# EasyEDA Pro project ProProject_无线温湿度检测系统1_2024-10-27.epro, board V2.1
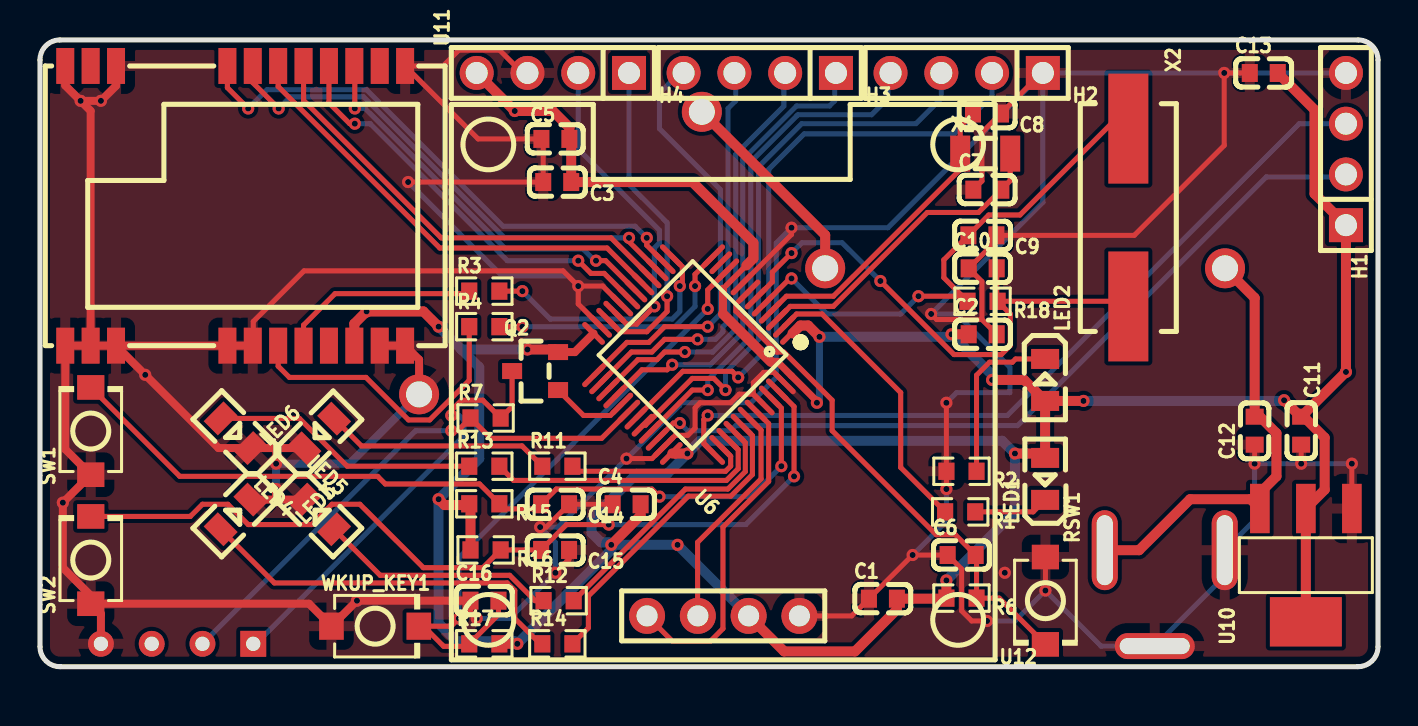
[diagram p11: board, top side]
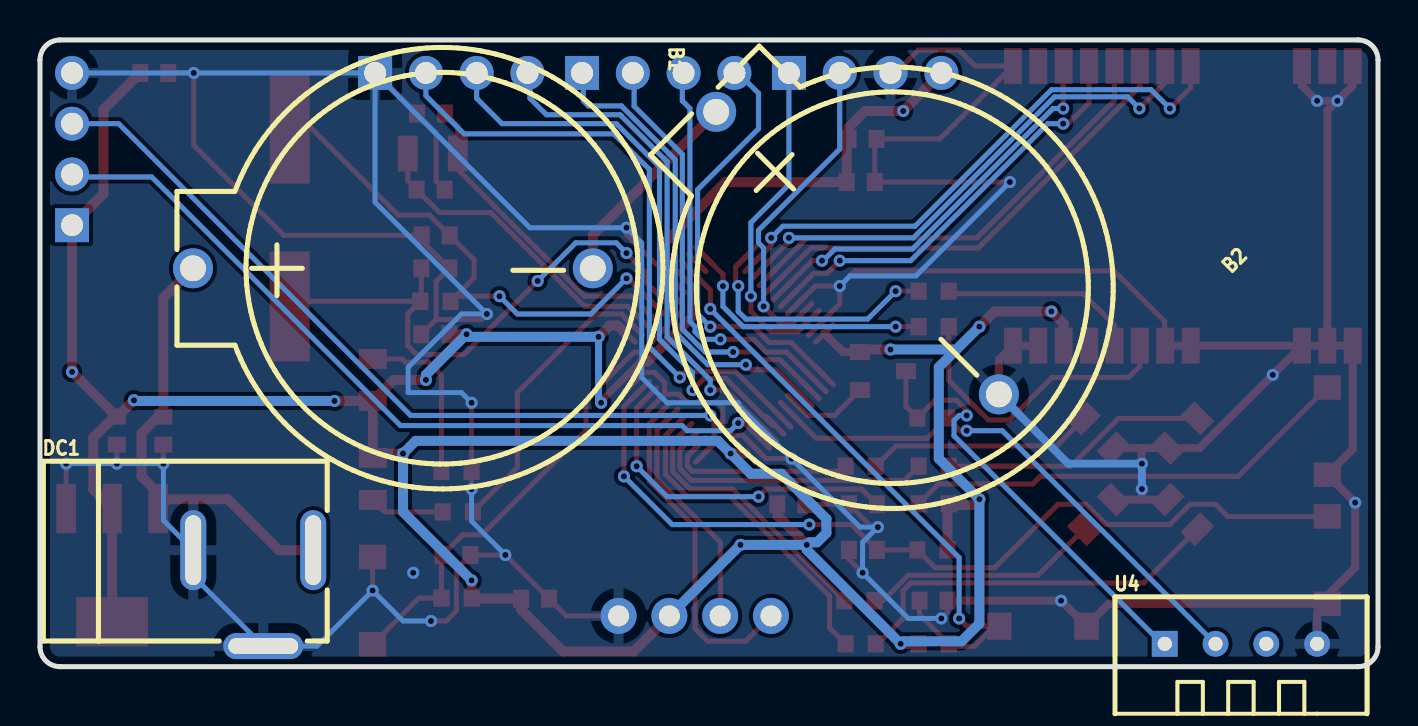
[diagram p12: board, bottom side, seen from below]

Outline 66.93 x 31.37 mm; copper layers: Top Layer, Inner1, Inner2, Bottom Layer. Coordinates in mm from the lower left corner of the outline.
Outline path: 0,30.37 0,1 arc(0.29,0.29) 1,0 65.93,0 arc(66.64,0.29) 66.93,1 66.93,30.37 arc(66.64,31.08) 65.93,31.37 1,31.37 arc(0.29,31.08) 0,30.37
Stack: Top Layer 0.035mm 外层铜厚1oz / Dielectric1 0.2104mm 7628 RC49% 8.6mil / Inner1 0.0152mm 内层铜厚 / Dielectric2 1.065mm 1.1mm H/HOZ 含铜 / Inner2 0.0152mm 内层铜厚 / Dielectric3 0.2104mm 7628 RC49% 8.6mil / Bottom Layer 0.035mm 外层铜厚1oz

## Design rules (mm)
template: JLCPCB Capability(Two Layers Board)
spacing copperThickness1oz (default): track to track 0.102, other pairs 0.152 to 0.3
spacing copperThickness2oz: track to track 0.203, other pairs 0.152 to 0.3
track width copperThickness1oz (default): min 0.127, default 0.254, max 2.54
track width copperThickness2oz: min 0.203, default 0.254, max 2.54
differential pair differentialPair (default): width min 0.127, default 0.254, max 2.54; gap min 0.152, default 0.152
via viaSize (default): diameter min 0.5, default 0.61, max 10; hole min 0.3, default 0.305, max 6.3

## Placement (name value [footprint] x y rotation side)
B1  BS-2-1  [BAT-TH_BS-2-1]  49.28 19.94 270 bottom
B2  BS-2-1  [BAT-TH_BS-2-1]  26.03 20.7 315 bottom
C1  100nF  [C0603]  42.16 3.4 0 top
C2  100nF  [C0603]  47.16 16.64 0 top
C3  100nF  [C0603]  25.87 24.26 180 top
C4  100nF  [C0603]  29.34 8.13 0 top
C5  100nF  [C0603]  25.78 26.42 0 top
C6  1uF  [C0603]  46.1 5.59 0 top
C7  20pF  [C0603]  47.39 23.88 0 top
C8  20pF  [C0603]  47.37 27.69 180 top
C9  20pF  [C0603]  47.14 21.59 180 top
C10  20pF  [c0603]  47.16 19.94 0 top
C11  100nF  [C0603]  63.09 11.81 270 top
C12  1uF  [C0603]  60.76 11.81 90 top
C13  1uF  [C0603]  61.21 29.72 0 top
C14  1uF  [C0603]  25.77 8.13 180 top
C15  1uF  [C0603]  25.77 5.84 180 top
C16  1uF  [C0603]  22.23 3.3 0 top
DC1  DC-005 2.0  [DC-IN-TH_DC-5520-1]  56.26 3.43 180 bottom
H1  烧录  [HDR-TH_4P-P2.54-V-M]  65.32 25.91 90 top
H2  烧录  [HDR-TH_4P-P2.54-V-M]  46.35 29.72 180 top
H3  烧录  [HDR-TH_4P-P2.54-V-M]  36 29.72 180 top
H4  烧录  [HDR-TH_4P-P2.54-V-M]  25.65 29.72 180 top
LED1  NCD0805R1  [LED0805-R-RD]  50.28 9.4 90 top
LED2  NCD0805R1  [LED0805-R-RD]  50.28 14.35 270 top
LED3  NCD0805R1  [LED0805-R-RD]  9.78 7.62 225 top
LED4  NCD0805R1  [LED0805-R-RD]  9.78 11.68 135 top
LED5  NCD0805R1  [LED0805-R-RD]  13.97 7.62 315 top
LED6  NCD0805R1  [LED0805-R-RD]  13.97 11.67 45 top
Q2  AO3401A  [SOT-23_L2.9-W1.3-P1.90-LS2.4-BR]  24.76 14.8 0 top
R1  510Ω  [R0603]  46.03 7.75 180 top
R2  510Ω  [R0603]  46.09 9.78 180 top
R3  200Ω  [R0603]  22.22 18.8 0 top
R4  200Ω  [R0603]  22.22 17.02 0 top
R6  10kΩ  [R0603]  46.09 3.43 180 top
R7  4.7kΩ  [R0603]  22.29 12.45 0 top
R11  510Ω  [R0603]  25.88 10.03 0 top
R12  510Ω  [R0603]  25.94 3.3 0 top
R13  510Ω  [r0603]  22.22 10.03 0 top
R14  510Ω  [R0603]  25.88 1.14 0 top
R15  10kΩ  [R0603]  22.22 8.15 180 top
R16  10kΩ  [R0603]  22.29 5.84 180 top
R17  10kΩ  [R0603]  22.22 1.14 0 top
R18  1MΩ  [R0603]  47.15 18.29 180 top
RSW1  TS-1088R-02026  [SW-SMD_L3.9-W3.0-P4.45]  50.29 3.3 270 top
SW1  TS-1088-AR02016  [SW-SMD_L3.9-W3.0-P4.45]  2.54 11.79 90 top
SW2  TS-1088-AR02016  [SW-SMD_L3.9-W3.0-P4.45]  2.54 5.33 90 top
U4  DHT11  [SENSOR-TH_DHT11]  6.86 1.14 180 bottom
U6  STM32F103C8T6  [LQFP-48_L7.0-W7.0-P0.50-LS9.0-BL]  32.64 15.62 135 top
U10  AMS1117-3.3  [SOT-223-4_L6.5-W3.5-P2.30-LS7.0-BR]  63.32 5.08 90 top
U11  E22-400M22S  [WIRELM-SMD_E22-400M22S]  9.76 23.07 270 top
U12  HS96L03W2C03  [OLED-TH_L27.8-W27.2-P2.54_C9900033791]  34.18 2.54 180 top
WKUP_KEY1  TS-1088-AR02016  [SW-SMD_L3.9-W3.0-P4.45]  16.76 2.03 0 top
X1  32.768kHz  [FC-135R_L3.2-W1.5]  47.28 25.68 0 top
X2  8MHz  [CRYSTAL-SMD_L11.5-W4.8-LS12.7]  54.44 22.48 270 top

## Footprints (pads in the part's own frame, mm; a bottom-side part is the same pattern mirrored in y, then rotated)
BAT-TH_BS-2-1
  round 2 hole 1.3: 1(0,-10) 2(0,10)
C0603
  rect 0.8x0.9 smd: 1(-0.7,0) 2(0.7,0)
c0603
  rect 0.8x0.9 smd: 1(-0.7,0) 2(0.7,0)
CRYSTAL-SMD_L11.5-W4.8-LS12.7
  rect 5.5x2 smd: 1(-4.45,0) 2(4.45,0)
DC-IN-TH_DC-5520-1
  oval 4x1.3 hole 3.5x0.8: 2(0.5,-2.4)
  oval 1.3x4 hole 0.8x3.5: 3(-3,2.4) 4(3,2.4)
FC-135R_L3.2-W1.5
  rect 1x1.8 smd: 1(-1.25,0) 2(1.25,0)
HDR-TH_4P-P2.54-V-M
  rect 1.7x1.7 hole 1.1: 1(-3.81,0)
  round 1.7 hole 1.1: 2(-1.27,0) 3(1.27,0) 4(3.81,0)
LED0805-R-RD
  rect 1x1.399 smd: 1(1.05,0) 2(-1.05,0)
LQFP-48_L7.0-W7.0-P0.50-LS9.0-BL
  oval 0.27x1.5 smd: 1(-2.75,-4.25) 2(-2.25,-4.25) 3(-1.75,-4.25) 4(-1.25,-4.25) 5(-0.75,-4.25) 6(-0.25,-4.25) 7(0.25,-4.25) 8(0.75,-4.25) 9(1.25,-4.25) 10(1.75,-4.25) 11(2.25,-4.25) 12(2.75,-4.25) 25(2.75,4.25) 26(2.25,4.25) 27(1.75,4.25) 28(1.25,4.25) 29(0.75,4.25) 30(0.25,4.25) 31(-0.25,4.25) 32(-0.75,4.25) 33(-1.25,4.25) 34(-1.75,4.25) 35(-2.25,4.25) 36(-2.75,4.25)
  oval 1.5x0.27 smd: 13(4.25,-2.75) 14(4.25,-2.25) 15(4.25,-1.75) 16(4.25,-1.25) 17(4.25,-0.75) 18(4.25,-0.25) 19(4.25,0.25) 20(4.25,0.75) 21(4.25,1.25) 22(4.25,1.75) 23(4.25,2.25) 24(4.25,2.75) 37(-4.25,2.75) 38(-4.25,2.25) 39(-4.25,1.75) 40(-4.25,1.25) 41(-4.25,0.75) 42(-4.25,0.25) 43(-4.25,-0.25) 44(-4.25,-0.75) 45(-4.25,-1.25) 46(-4.25,-1.75) 47(-4.25,-2.25) 48(-4.25,-2.75)
OLED-TH_L27.8-W27.2-P2.54_C9900033791
  round 1.8 hole 1.05: 1(-3.81,0) 2(-1.27,0) 3(1.27,0) 4(3.81,0)
R0603
  rect 0.806x0.864 smd: 1(-0.753,0) 2(0.753,0)
r0603
  rect 0.806x0.864 smd: 1(-0.753,0) 2(0.753,0)
SENSOR-TH_DHT11
  rect 1.296x1.296 hole 0.711: 1(-3.81,0)
  round 1.296 hole 0.711: 2(-1.27,0) 3(1.27,0) 4(3.81,0)
SOT-23_L2.9-W1.3-P1.90-LS2.4-BR
  rect 1x0.8 smd: 1(1.15,-0.95) 2(1.15,0.95) 3(-1.15,0)
SOT-223-4_L6.5-W3.5-P2.30-LS7.0-BR
  rect 2.47x0.98 smd: 1(2.835,-2.3) 2(2.835,0) 3(2.835,2.3)
  rect 2.47x3.6 smd: 4(-2.835,0)
SW-SMD_L3.9-W3.0-P4.45
  rect 1.23x1.36 smd: 1(-2.185,0) 2(2.185,0)
WIRELM-SMD_E22-400M22S
  rect 1.8x0.9 smd: 1(7,-8.5) 2(7,-7.23) 3(7,-5.96) 4(7,-0.39) 5(7,0.88) 6(7,2.15) 7(7,3.42) 8(7,4.69) 9(7,5.96) 10(7,7.23) 11(7,8.5) 12(-7,8.5) 13(-7,7.23) 14(-7,5.96) 15(-7,4.69) 16(-7,3.42) 17(-7,2.15) 18(-7,0.88) 19(-7,-0.39) 20(-7,-5.96) 21(-7,-7.23) 22(-7,-8.5)

## Nets
As in the schematic.

Pads without a net: U4 3; U6 11; U11 8 13 21

## Via types
v1: diameter 0.61, hole 0.305, Top Layer to Bottom Layer, 78 vias

## Routing (per net, layer and track width the routed paths; a pad name or vN(x,y) marks a point on that pad's centre or on a via; arc(x,y) is an arc through that point)
12V&B_VCC: length 22.6
  Top Layer w0.5: B1.1 60.76,18.45 C12.2 61.02,12.51 61.85,11.68 61.85,9.53 61.02,8.7 61.02,7.92 60.55,8.38 57.53,8.38 54.98,5.83 53.26,5.83
GND: length 347.8
  Top Layer w0.25: R2.2 v1(45.34,13.21) ; R2.2 45.34,8.89 ; R2.2 v1(45.34,8.89) ; U6.44 35.68,13.64 ; 35.68,13.64 35.68,14.22 36.19,14.73 36.71,14.73 37.24,14.21 ; 35.68,13.64 34.98,13.64 34.54,13.21 33.02,13.21 32.77,12.95 32.77,11.94 32.41,11.58 31.78,11.58 U6.35 30.61,10.41 v1(29.34,10.41) ; v1(25.02,6.98) 25.32,6.98 C14.1 C4.1 ; C16.1 21.53,2.72 v1(21.84,2.41) ; C11.2 v1(63.09,10.16) ; v1(47.37,2.29) 46.61,2.29 46.1,2.79 46.1,4.89 C6.1 v1(43.65,5.59) C1.1 40.6,2.54 U12.1 ; 65.62,7.92 v1(65.62,10.16) ; RSW1.1 v1(50.29,3.81) ; C12.1 60.76,10.16 v1(60.76,10.16) ; C15.1 26.47,5.38 v1(25.78,4.7)
  Top Layer w0.254: U6.20 28.15,19.05 v1(26.92,19.05) ; H2.1 50.1,29.72 C8.1 47.12,26.73 47.12,24.31 C7.1 ; U6.8 37.59,21.63 v1(37.59,21.97) ; v1(44.58,17.65) 44.85,17.38 47.12,17.38 ; C13.1 60.51,29.72 v1(59.24,29.72) 59.24,26.09 54.74,21.59 C9.1 47.84,21.32 C10.1 47.12,19.28 47.12,17.38 ; 47.12,17.38 C2.2 ; 28.04,17.03 26.92,18.15 v1(26.92,19.05) ; v1(18.41,24.26) C3.2 25.17,26.33 25.08,26.42 21.91,26.42 U11.12 20.16,30.07 20.96,30.86 22.99,30.86 24.13,29.72 H4.3 ; v1(26.92,19.05) 26.16,19.81 13.21,19.81 10.67,17.27 10.67,16.09 U11.5
  Top Layer w0.4: U11.3 U11.4 U11.5 ; U11.3 U11.2 ; U11.3 v1(5.27,14.61) 8.93,10.94 LED4.2 11.83,10.94 ; LED3.2 11.8,8.36 ; 11.8,8.36 11.81,8.37 v1(11.81,8.89) ; 11.8,8.36 LED5.2 ; LED6.2 13.22,10.94 11.83,10.94 ; 11.83,10.94 11.83,10.17 v1(11.81,10.16) ; U11.20 3.8,29.08 v1(3.05,28.32) v1(2.03,28.32) ; U4.4 3.05,2.64 SW2.1 ; v1(2.03,28.32) 1.26,29.09 U11.22 ; v1(2.03,28.32) 2.53,27.82 U11.2 ; U11.2 U11.1 1.26,10.88 2.54,9.61 v1(1.14,8.21) 1.14,4.95 2.54,3.56 SW2.1 ; SW2.1 13.46,3.15 WKUP_KEY1.1 v1(15.85,3.3) C16.1 ; B2.2 18.96,15.37 U11.11 U11.10
  Bottom Layer w0.25: 45.47,13.33 45.85,13.72 48.51,13.72 48.51,14.99 45.85,17.65 v1(44.58,17.65) ; v1(65.62,10.16) v1(63.09,10.16) v1(60.76,10.16) 60.76,7.32 59.26,5.83 59.26,4.53 DC1.2 53.07,1.03 v1(50.29,3.81) 48.77,2.29 v1(47.37,2.29) ; v1(43.65,5.59) 45.34,7.28 v1(45.34,8.89) ; v1(37.59,21.97) 36.83,21.21 36.83,14.48 35.56,13.21 32,13.21 32,13.08 v1(29.34,10.41) 25.91,6.98 v1(25.02,6.98) 25.78,6.22 v1(25.78,4.7) 23.5,2.41 v1(21.84,2.41)
  Bottom Layer w0.254: v1(44.58,17.65) 50.16,23.24 H2.1 ; H2.1 v1(59.24,29.72) H1.4 ; H2.1 42.42,21.97 v1(37.59,21.97) ; v1(18.41,24.26) 23.11,19.56 26.42,19.56 v1(26.92,19.05)
  Bottom Layer w0.4: B2.2 15.49,10.16 v1(11.81,10.16) v1(11.81,8.89)
  vias: v1(48.26,4.7)
VCC: length 199.2
  Top Layer w0.25: U6.9 34.16,18.91
  Top Layer w0.35: v1(38.86,13.21) 38.86,13.29 U6.48 36.89,15.26
  Top Layer w0.4: 36.56,15.26 36.89,15.26 ; U6.24 26.75,15.75 Q2.2 ; 34.16,18.91 34.16,17.65
  Top Layer w0.5: 31.63,10.67 31.78,10.67 31.78,10.67 v1(32.38,10.67) ; C13.2 63.75,27.88 63.75,23.67 H1.1 v1(65.32,14.75) 63.15,12.57 ; 35.33,20.08 35.69,20.44 35.69,21.21 32.64,24.26 C3.1 26.57,26.33 C5.2 26.48,26.99 25.65,27.81 v1(23.75,27.81) H4.4 ; 21.53,8.09 20.23,8.09 v1(19.94,8.38) ; 21.53,8.09 R15.2 ; 21.53,8.09 R16.2 ; v1(45.59,16.64) C2.1 ; LED2.1 49.23,14.35 v1(47.62,14.35) ; LED2.1 LED1.1 50.06,10.67 v1(48.77,10.67) ; LED2.1 v1(52.2,13.3) ; v1(45.34,4.32) R6.2 45.31,3.4 C1.2 42.86,2.86 40.77,0.76 37.22,0.76 U12.2 ; 63.15,12.57 64.26,11.46 64.26,8.86 63.32,7.92 U10.4 ; 63.15,12.57 C11.1 63.05,12.51 v1(62.23,13.33) ; 37.64,16.68 38.03,17.07 38.42,17.07 v1(38.99,16.51) ; v1(19.94,17.02) 19.18,17.78 v1(16.34,17.78) 15.72,17.17 U11.9 ; v1(28.57,6.1) 30.04,7.56 C4.2 ; 34.16,17.65 36.56,15.26 ; Q2.2 25.78,15.88 v1(24.38,15.88) ; v1(23.88,1.14) R17.2
  Bottom Layer w0.35: v1(38.86,13.21) 38.99,13.33 v1(38.99,16.51)
  Bottom Layer w0.5: v1(28.57,6.1) v1(31.89,6.1) U12.2 ; v1(28.57,6.1) 28.45,6.22 28.06,6.22 27.59,6.69 27.59,7.4 29.84,9.65 31.37,9.65 v1(32.38,10.67) 33.02,11.3 48.13,11.3 v1(48.77,10.67) 48.77,7.75 v1(45.34,4.32) ; v1(28.57,6.1) 28.57,5.84 v1(23.88,1.14) 23.75,1.27 20.83,1.27 19.94,2.16 v1(19.94,8.38) 21.97,10.41 21.97,14.99 21.08,15.88 ; v1(47.62,14.35) 47.62,14.61 v1(45.59,16.64) 45.47,16.51 v1(38.99,16.51) ; 21.08,15.88 v1(19.94,17.02) ; 21.08,15.88 v1(24.38,15.88) ; v1(52.2,13.3) 62.2,13.3 v1(62.23,13.33)
DHT11_VCC: length 22.2
  Top Layer w0.254: 23.62,14.8 23.62,13.02 R7.2 22.15,13.33 21.08,13.33 20.57,12.83 v1(20.57,12.57)
  Bottom Layer w0.254: U4.1 10.79,1.14 21.21,11.56 21.21,12.32 20.96,12.57 v1(20.57,12.57)
NRST: length 25.8
  Top Layer w0.254: RSW1.2 47.98,3.43 46.85,3.43 46.85,5.54 C6.2 45.78,6.6 44.83,6.6 39.62,11.81 39.62,13.33 37.21,15.75 36.85,15.75 34.81,17.79 34.81,18.15 35.47,18.8
PA2/USART2_TX: length 13.1
  Top Layer w0.254: R4.2 v1(24.13,17.02) ; v1(32.77,19.05) 32.77,19.64 U6.12
  Bottom Layer w0.254: v1(32.77,19.05) 32.77,18.03 31.75,17.02 v1(24.13,17.02)
PA3/USART2_RX: length 12.8
  Top Layer w0.254: U6.13 32.13,20.02 32.13,19.18 v1(32,19.05) ; R3.2 v1(24.13,18.8)
  Bottom Layer w0.254: v1(32,19.05) 32,17.78 31.62,17.4 25.53,17.4 v1(24.13,18.8)
PA4/SPI1_NSS: length 27.6
  Top Layer w0.254: U11.19 9.37,28.98 v1(10.41,27.94) ; v1(30.35,21.46) 30.35,21.09 31.22,20.22
  Bottom Layer w0.254: v1(10.41,27.94) 11.35,28.88 16.33,28.88 23.16,22.05 29.77,22.05 v1(30.35,21.46)
PA5/SPI1_SCK: length 25.5
  Top Layer w0.254: v1(11.94,27.94) 10.64,29.23 U11.18 ; v1(29.46,21.46) 29.46,21.27 U6.15
  Bottom Layer w0.254: v1(29.46,21.46) 23.24,21.46 16.18,28.52 12.52,28.52 v1(11.94,27.94)
PA6/SPI1_MISO: length 22.7
  Top Layer w0.254: U6.16 28.56,21.46 20.07,21.46 13.18,28.34 U11.16
PA7/SPI1_MOSI: length 23.4
  Top Layer w0.254: U6.17 28.37,20.95 20,20.95 11.91,29.04 U11.17
PA8/DHT11_CONTROL_VCC: length 4
  Top Layer w0.254: U6.29 28.53,12.57 27.19,12.57 Q2.1
PA9/DATA: length 27
  Top Layer w0.254: 29.46,12.79 28.09,11.43 22.55,11.43 R7.1 20.9,11.81 v1(20.57,11.81)
  Bottom Layer w0.254: v1(20.57,11.81) 18.8,11.81 U4.2
PA10/: length 31.1
  Top Layer w0.254: v1(34.93,14.48) 34.62,14.78 32.15,14.78 U6.31
  Bottom Layer w0.254: H2.2 47.62,28.58 45.72,26.67 38.23,26.67 36.45,24.89 36.45,16 v1(34.93,14.48)
PA11/: length 29
  Top Layer w0.254: U6.32 30.28,12.09 32.63,14.43 33.71,14.43 v1(34.29,13.84)
  Bottom Layer w0.254: H2.3 45.09,28.45 43.81,27.18 38.1,27.18 35.94,25.02 35.94,16.38 34.29,14.73 v1(34.29,13.84)
PA12/: length 25.6
  Top Layer w0.254: v1(33.4,13.84) 32.63,13.84 U6.33
  Bottom Layer w0.254: H2.4 42.42,29.59 42.42,28.45 41.59,27.62 37.91,27.62 37.85,27.56 37.85,27.56 35.56,25.27 35.56,16.51 33.4,14.35 v1(33.4,13.84)
PA15_DEBUG1: length 9.3
  Top Layer w0.254: 34.05,11.03 34.55,10.53 34.55,10.04 34.29,9.78 26.89,9.78 R11.2
PB0/BUSY: length 20
  Top Layer w0.254: U11.14 15.75,30.04 v1(15.75,27.94) ; v1(27.81,20.32) 28.29,20.32 29.81,18.8
  Bottom Layer w0.254: v1(27.81,20.32) 27.75,20.32 27.17,20.9 23.29,20.9 16.26,27.94 v1(15.75,27.94)
PB1/NRST: length 20.9
  Top Layer w0.254: v1(15.75,27.18) 15.49,27.18 14.45,28.22 U11.15 ; v1(26.92,20.32) 27.56,19.69 28.22,19.69 29.46,18.45
  Bottom Layer w0.254: v1(15.75,27.18) 16.51,27.18 23.37,20.32 v1(26.92,20.32)
PB3_DEBUG3: length 14.2
  Top Layer w0.254: U6.39 34.93,10.86 34.93,9.91 34.34,9.32 23.69,9.32 R13.2
PB4_DEBUG2: length 13.4
  Top Layer w0.254: R12.2 32.28,8.89 34.41,8.89 35.28,9.76 35.28,11.21 U6.40
PB5_DEBUG4: length 16.1
  Top Layer w0.254: U6.41 35.64,11.56 35.64,9.62 34.55,8.53 32.43,8.53 27.43,3.53 27.43,1.94 R14.2
PB6/I2C1_SCL: length 11.5
  Top Layer w0.254: U12.3 32.89,2.55 32.89,6.22 36.07,9.4 36.07,11.84 U6.42
PB7/I2C1_SDA: length 16.7
  Top Layer w0.254: U6.43 36.45,12.16 36.45,9.27 34.16,6.98 34.16,1.91 33.53,1.27 31.64,1.27 U12.4
PB8/KEY_1: length 42.1
  Top Layer w0.254: SW1.2 6.99,9.53 16.89,9.53 17.27,9.14 21.99,9.14 R15.1 23.23,7.9 25.07,7.9 C14.2 25.83,8.89 30.61,8.89 v1(30.99,8.51) ; U6.45 37.08,12.94 v1(37.08,10.03)
  Bottom Layer w0.254: v1(37.08,10.03) 35.56,8.51 v1(30.99,8.51)
PB9/KEY_2: length 44.3
  Top Layer w0.254: v1(37.72,9.53) 37.72,13.02 U6.46 ; C15.2 26.34,7.11 v1(28.45,7.11) ; C15.2 R16.1 22.15,4.95 19.18,4.95 16,8.13 14.6,8.13 13.59,7.11 10.41,7.11 9.4,8.13 8.13,8.13 7.52,7.52 SW2.2 ; C15.2 25.07,5.97
  Bottom Layer w0.254: v1(37.72,9.53) 35.31,7.11 v1(28.45,7.11)
PB10/: length 16.1
  Top Layer w0.254: v1(30.73,18.03) 29.84,17.14 29.35,17.14 U6.21
  Bottom Layer w0.254: H4.2 26.92,25.91 30.99,21.84 30.99,21.21 30.73,20.95 v1(30.73,18.03)
PB11/: length 16.4
  Top Layer w0.254: U6.22 29.02,16.76 30.35,16.76 31.37,17.78 v1(31.37,18.54)
  Bottom Layer w0.254: H4.1 29.46,24.13 31.37,22.22 v1(31.37,18.54)
PB12/: length 21.6
  Top Layer w0.254: U6.25 29.36,16.23 30.45,16.23 31.24,17.02 v1(33.4,17.02)
  Bottom Layer w0.254: v1(33.4,17.02) 34.04,17.65 34.04,23.88 30.99,26.92 30.99,28.7 32,29.72 H3.4
PB13/: length 20.4
  Top Layer w0.254: v1(32.89,16.38) 31.24,16.38 30.61,15.75 29.58,15.75 28.04,14.21
  Bottom Layer w0.254: H3.3 34.8,29.65 34.8,28.32 34.42,27.94 34.42,17.27 34.16,17.02 34.16,16.76 33.78,16.38 v1(32.89,16.38)
PB14/: length 21.5
  Top Layer w0.254: v1(32.26,15.75) 31.24,15.75 30.86,15.37 29.91,15.37 U6.27
  Bottom Layer w0.254: v1(32.26,15.75) 33.66,15.75 34.8,16.89 34.8,25.64 37.21,28.06 37.21,29.65 H3.2
PB15/: length 23.6
  Top Layer w0.254: v1(31.62,15.11) 31.37,14.86 30.11,14.86 U6.28
  Bottom Layer w0.254: H3.1 39.75,29.65 39.75,28.32 39.5,28.07 37.85,28.07 35.15,25.38 35.15,16.74 35.05,16.64 35.05,16.64 33.53,15.11 v1(31.62,15.11)
PC13/TAMPER-RTC: length 14.6
  Top Layer w0.254: R1.2 43.05,9.97 43.05,13.72 39.12,17.65 37.85,17.65 37.24,17.04 U6.2
PC14/OSC32_IN: length 15.5
  Top Layer w0.254: U6.3 37.53,18.03 39.68,18.03 44.38,22.73 46.94,22.73 C7.2 48.53,24.32 48.53,25.3
PC15/OSC32_OUT: length 15.5
  Top Layer w0.254: U6.4 36.54,17.74 37.34,18.54 39.69,18.54 46.03,24.88 X1.1 46.03,27.05 C8.2
PD0/OSC_IN: length 26.7
  Top Layer w0.254: U6.5 37.51,19.43 v1(37.59,19.43) ; 54.48,28.07 49.02,22.61 47.46,22.61 C9.2 45.21,20.36 45.21,19.47 46.14,18.54 ; 46.14,18.54 R18.2 ; 46.14,18.54 v1(43.94,18.54)
  Bottom Layer w0.254: v1(37.59,19.43) 39.37,17.65 43.05,17.65 v1(43.94,18.54)
PD1/OSC_OUT: length 27.7
  Top Layer w0.254: R18.1 48.53,17.65 48.53,16.07 48.08,15.62 45.72,15.62 v1(42.04,19.3) ; R18.1 47.85,18.33 C10.2 ; R18.1 53.6,18.29 54.48,19.17 ; U6.6 36.63,19.26 36.63,19.74 v1(37.59,20.7)
  Bottom Layer w0.25: 41.68,19.66 40.12,21.22 38.11,21.22 v1(37.59,20.7)
  Bottom Layer w0.254: v1(42.04,19.3) 41.68,19.66
SWDCLK: length 40.2
  Top Layer w0.254: v1(33.4,12.57) 33.2,12.38 33.2,11.17 U6.37
  Bottom Layer w0.254: H1.3 62.99,27.18 48.39,12.57 v1(33.4,12.57)
SWDIO: length 40.3
  Top Layer w0.254: U6.34 31.69,12.19 v1(32,12.19)
  Bottom Layer w0.25: v1(32,12.19) 32.38,11.81 34.55,11.81 34.81,12.06
  Bottom Layer w0.254: 34.81,12.06 48.9,12.06 61.34,24.51 65.2,24.51 H1.2
WKUP_KEY: length 30.3
  Top Layer w0.254: v1(20.96,2.41) 20.57,2.03 19.18,2.03 ; v1(33.4,17.91) 33.4,18.86 U6.10 ; 19.18,2.03 20.19,1.02 21.34,1.02 R17.1 22.93,2.6 22.93,2.92 ; 19.18,2.03 WKUP_KEY1.2
  Bottom Layer w0.254: v1(33.4,17.91) 20.96,5.46 v1(20.96,2.41)
$1N2773: length 8.6
  Top Layer w0.25: LED2.2 48.8,15.4 48.64,15.24 47.5,15.24 46.85,14.59 46.85,9.78
$1N2774: length 3.7
  Top Layer w0.254: R1.1 49.68,7.75 LED1.2
$1N2793: length 15.2
  Top Layer w0.254: U11.6 11.91,15.04 12.48,14.48 16.31,14.48 18.43,12.35 19.49,12.35 21.47,14.33 R4.1
$1N2798: length 10
  Top Layer w0.254: R3.1 21.34,18.67 14.76,18.67 13.18,17.09 U11.7
$1N2893: length 10.4
  Top Layer w0.5: B2.1 39.28,21.6 B1.2
$1N4741: length 11.5
  Top Layer w0.254: LED6.1 16.08,11.05 24.11,11.05 R11.1 25.17,9.98
$1N4780: length 12
  Top Layer w0.254: LED5.1 17.02,4.57 23.5,4.57 24.76,3.3 R12.1
$1N4819: length 13.4
  Top Layer w0.254: LED4.1 12.97,12.43 15.37,10.03 R13.1
$1N4858: length 19.3
  Top Layer w0.254: R14.1 25.02,1.14 23.75,2.41 23.75,3.81 23.37,4.19 11.72,4.19 LED3.1

## Copper pours and planes (outline as drawn; the poured copper is in the pictures)
GND on Top Layer: -0.04,31.43 66.93,31.43 66.93,0 -0.04,0
GND on Bottom Layer: 0.05,31.31 66.93,31.31 66.93,0 0.05,0
GND on Inner1: 0,31.37 66.93,31.37 66.93,0 0,0
GND on Inner2: 0,31.37 20.33,31.37 20.33,15.68 0,15.68
VCC on Inner2: 20.4,31.37 66.93,31.37 66.93,0 0,0 0,15.43 20.58,15.43 20.58,31.19
